# EAGLE design sensor2 (EAGLE 6.4)
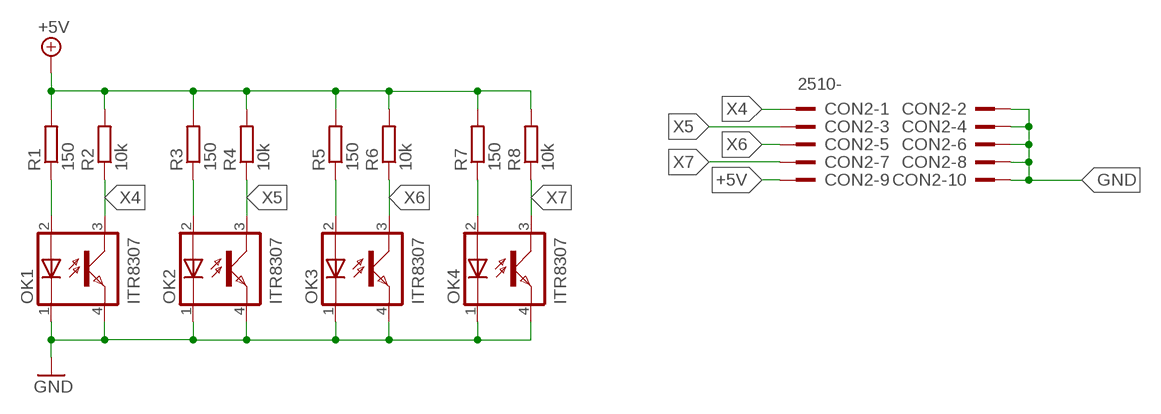
[diagram p0: schematic, sheet 1]

## Parts
CON2  2510-  [PAK100/2500-10]
OK1  ITR8307  [F43]
OK2  ITR8307  [F43]
OK3  ITR8307  [F43]
OK4  ITR8307  [F43]
R1  150  R-EU_0204/7  [0204/7]
R2  10k  R-EU_0204/7  [0204/7]
R3  150  R-EU_0204/7  [0204/7]
R4  10k  R-EU_0204/7  [0204/7]
R5  150  R-EU_0204/7  [0204/7]
R6  10k  R-EU_0204/7  [0204/7]
R7  150  R-EU_0204/7  [0204/7]
R8  10k  R-EU_0204/7  [0204/7]

## Nets
+5V: CON2.9 R1.2 R2.2 R3.2 R4.2 R5.2 R6.2 R7.2 R8.2
GND: CON2.2 CON2.4 CON2.6 CON2.8 CON2.10 OK1.1(C) OK1.4(EMIT) OK2.1(C) OK2.4(EMIT) OK3.1(C) OK3.4(EMIT) OK4.1(C) OK4.4(EMIT)
N$1: OK1.2(A) R1.1
N$4: OK2.2(A) R3.1
N$5: OK3.2(A) R5.1
N$6: OK4.2(A) R7.1
X4: CON2.1 OK1.3(COL) R2.1
X5: CON2.3 OK2.3(COL) R4.1
X6: CON2.5 OK3.3(COL) R6.1
X7: CON2.7 OK4.3(COL) R8.1

## Library data of the parts
CON2 = con-3m:2510-: 3M (TM) Pak 100 4-Wall Header Source: 3M; MF: 3M; MPN: 2510-6002UB; OC_FARNELL: 9838244; OC_NEWARK: 46F4725
OK1-OK4 = everlight:ITR8307: SIEMENS OPTO COUPLER; OC_FARNELL: unknown; OC_NEWARK: unknown
R1-R8 = resistor:R-EU_: RESISTOR, European symbol

## Board
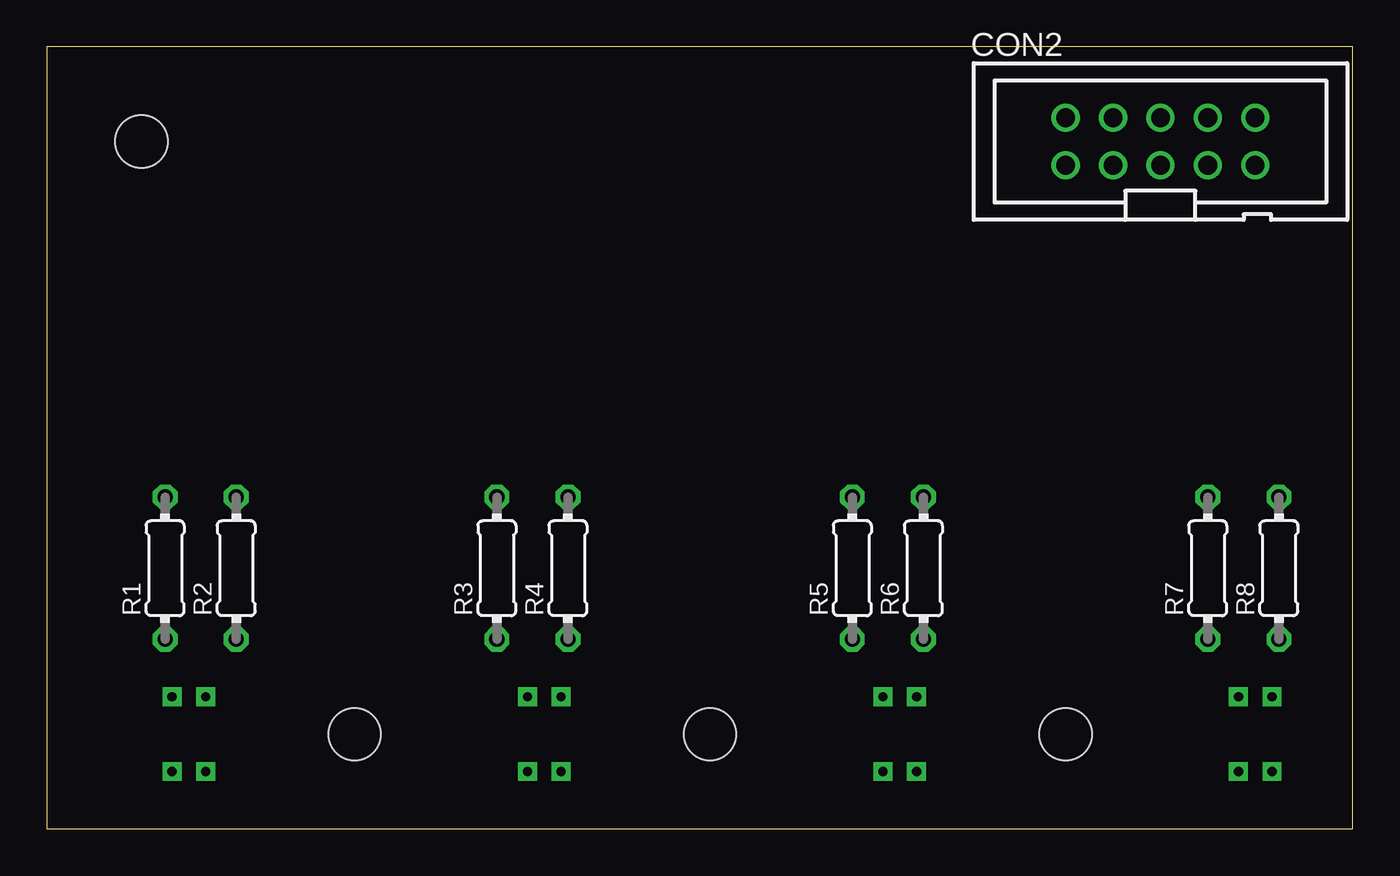
[diagram p1: board, top side]
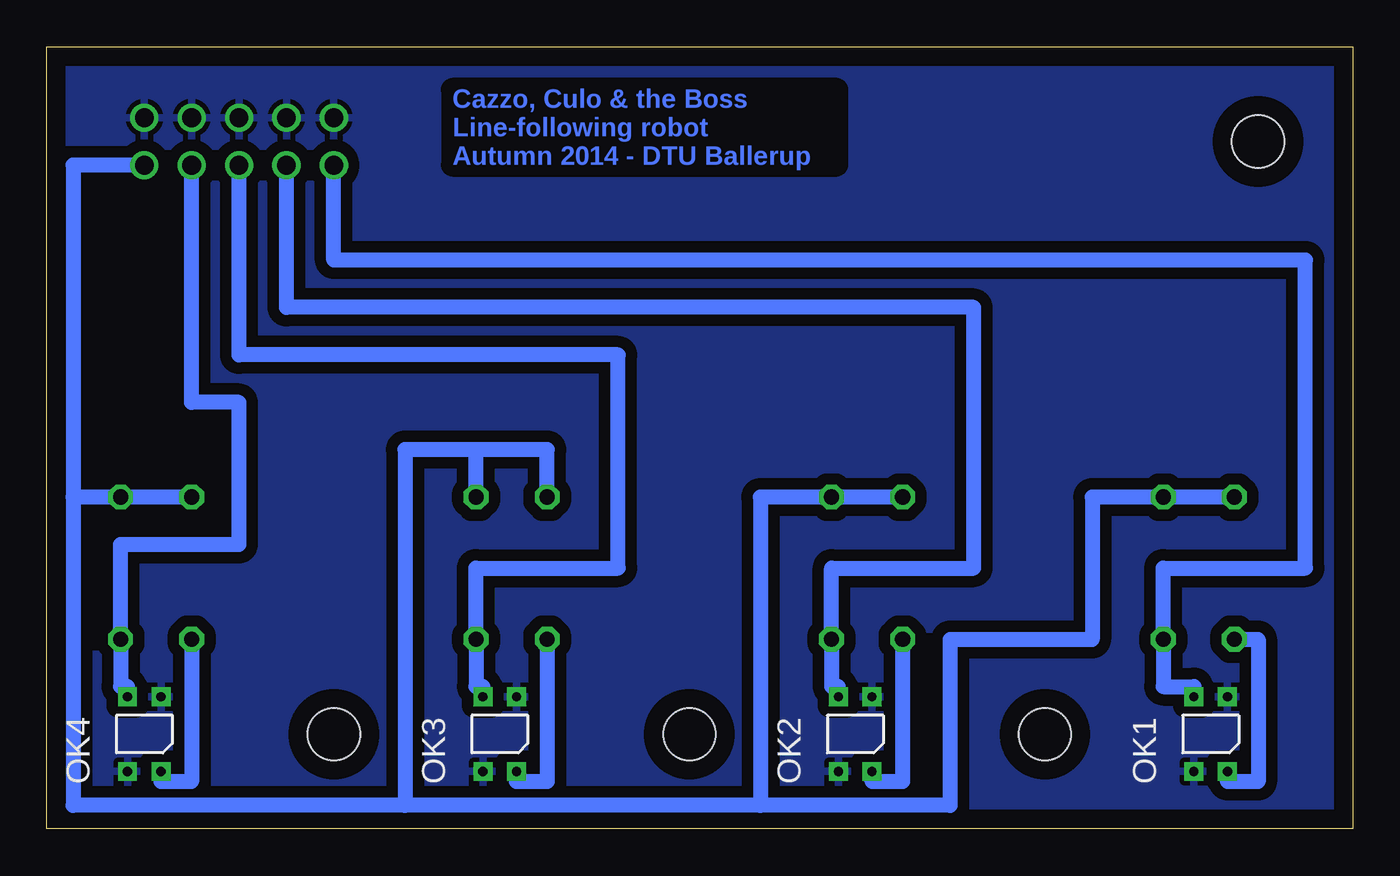
[diagram p2: board, bottom side, seen from below]

Size 70 x 41.91 mm. Coordinates in mm from the lower left corner, seen from the top.
Outline: 0,0 70,0 70,41.91 0,41.91 0,0
Copper layers (1*16): Top 0.035mm / dielectric 1.5mm / Bottom 0.035mm
Design rules "default": minimum track width 10mil, minimum drill 24mil, track to track 8mil, track to pad 8mil, pad to pad 8mil, via to via 8mil, smd to smd 8mil, copper to edge 40mil, drill to drill 8mil, minimum pad ring 10mil, minimum via ring 8mil, stop-mask expansion 4mil, vias tented up to drill 0mil, thermal gap 10mil
Holes 2.8 mm at 5.08,36.83 16.51,5.08 35.56,5.08 54.61,5.08

### Footprints (pad centres in the part's own frame; a part is rotated, then mirrored left to right if it is on the bottom)
PAK100/2500-10 = drill 1 pad 1.422: 1 -5.08,-1.27; 2 -5.08,1.27; 3 -2.54,-1.27; 4 -2.54,1.27; 5 0,-1.27; 6 0,1.27; 7 2.54,-1.27; 8 2.54,1.27; 9 5.08,-1.27; 10 5.08,1.27
F43 = drill 0.5 square: 1 0.9,2; 2 0.9,-2; 3 -0.9,2; 4 -0.9,-2
0204/7 = drill 0.813 octagon: 1 -3.81,0; 2 3.81,0

### Placement (x,y rotation side)
CON2  59.69,36.83 0 top
OK1  7.62,5.08 0 bottom
OK2  26.67,5.08 0 bottom
OK3  45.72,5.08 0 bottom
OK4  64.77,5.08 0 bottom
R1  6.35,13.97 90 top
R2  10.16,13.97 90 top
R3  24.13,13.97 90 top
R4  27.94,13.97 90 top
R5  43.18,13.97 90 top
R6  46.99,13.97 90 top
R7  62.23,13.97 90 top
R8  66.04,13.97 90 top

### Tracks (layer width: path | path; a pad name or v marks a point on that pad's centre or on a via)
+5V
  Bottom 0.813: R1.2 R2.2 13.97,17.78 13.97,10.16 21.59,10.16 21.59,1.27 31.75,1.27 | R3.2 R4.2 31.75,17.78 31.75,1.27 | R5.2 43.18,20.32 46.99,20.32 | R7.2 R8.2 68.58,17.78 | 68.58,17.78 68.58,1.27 50.8,1.27 | R6.2 46.99,20.32 | 46.99,20.32 50.8,20.32 50.8,1.27 | 31.75,1.27 50.8,1.27 | CON2.9 68.58,35.56 68.58,17.78
GND
  pour Bottom (isolate 0.61): 0,41.91 69.85,41.91 69.85,0 0,0
N$1
  Bottom 0.813: R1.1 5.08,10.16 5.08,2.54 6.72,2.54 OK1.2
N$4
  Bottom 0.813: R3.1 24.13,2.54 25.77,2.54 OK2.2
N$5
  Bottom 0.813: R5.1 43.18,2.54 44.82,2.54 OK3.2
N$6
  Bottom 0.813: R7.1 62.23,2.54 63.87,2.54 OK4.2
X4
  Bottom 0.406: 8.52,7.62 OK1.3
  Bottom 0.813: 8.52,7.62 10.16,7.62 R2.1 10.16,13.97 2.54,13.97 2.54,30.48 54.61,30.48 CON2.1
X5
  Bottom 0.406: 27.57,7.62 OK2.3
  Bottom 0.813: 27.57,7.62 27.94,7.62 R4.1 27.94,13.97 20.32,13.97 20.32,27.94 57.15,27.94 CON2.3
X6
  Bottom 0.406: 46.99,7.62 46.62,7.62
  Bottom 0.813: 46.99,7.62 R6.1 46.99,13.97 39.37,13.97 39.37,25.4 59.69,25.4 CON2.5 | 46.62,7.62 OK3.3
X7
  Bottom 0.406: 66.04,7.62 65.67,7.62
  Bottom 0.813: 66.04,7.62 R8.1 66.04,15.24 59.69,15.24 59.69,22.86 62.23,22.86 CON2.7 | 65.67,7.62 OK4.3

### Text on the board
Bottom: Cazzo, Culo & the Boss / Line-following robot / Autumn 2014 - DTU Ballerup